# Altium schematic sheet PS2.SchDoc
size A4
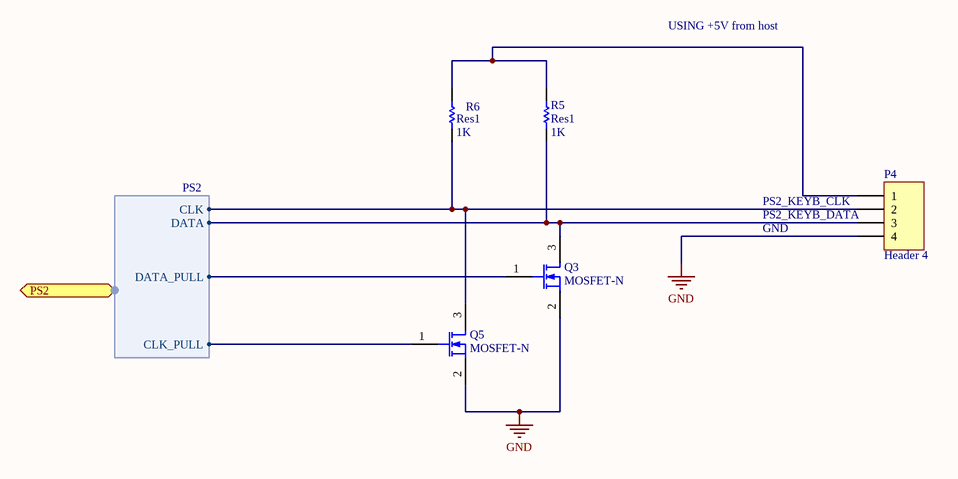
[diagram p0: PS2.SchDoc]

## Parts
P4  Header 4  [S04B-PASK-2]
Q3  MOSFET-N  [2N7002]
Q5  MOSFET-N  [2N7002]
R5  Res1  value 1K  [R0603]
R6  Res1  value 1K  [R0603]

## Ports
PS2 (harness PS2)

## Harnesses
PS2: CLK, DATA, DATA_PULL, CLK_PULL

## Nets
GND: P4.4 Q3.2(S) Q5.2(S)
NetP4_1: P4.1 R5.2 R6.2
NetP4_2: P4.2 Q5.3(D) R6.1 ; port PS2.CLK
NetP4_3: P4.3 Q3.3(D) R5.1 ; port PS2.DATA
NetQ3_1: Q3.1(G) ; port PS2.DATA_PULL
NetQ5_1: Q5.1(G) ; port PS2.CLK_PULL

## Notes on the sheet
- USING +5V from host
- (near P4) PS2_KEYB_CLK
- (near P4) PS2_KEYB_DATA
- GND

## Library data of the parts
P4 = Header 4: Header, 4-Pin; LatestRevisionDate: 17-Jul-2002; LatestRevisionNote: Re-released for DXP Platform.; Publisher: Altium Limited; farnell: 1830749
Q3 Q5 = MOSFET-N: N-Channel MOSFET; Published: 8-Jun-2000; LatestRevisionDate: 17-Jul-2002; LatestRevisionNote: Re-released for DXP Platform.; PackageVersion: 1995/1996; PackageReference: E3; Publisher: Altium Limited; farnell: 1510761
R5 R6 = Res1: Resistor; Published: 8-Jun-2000; LatestRevisionDate: 17-Jul-2002; LatestRevisionNote: Re-released for DXP Platform.; PackageReference: AXIAL-0.3; Publisher: Altium Limited; farnell: 9330402